# Altium schematic sheet Block_Diagram.SchDoc: Block Diagram
size Letter; Organization: Midnight Sun Solar Rayce Car Team; Address1: University of Waterloo; Address2: 200 University Ave W; Address3: Waterloo, ON, Canada; Address4: N2L 3E9; DocumentNumber: 1; SheetNumber: 1; SheetTotal: 5; Website: www.uwmidsun.com
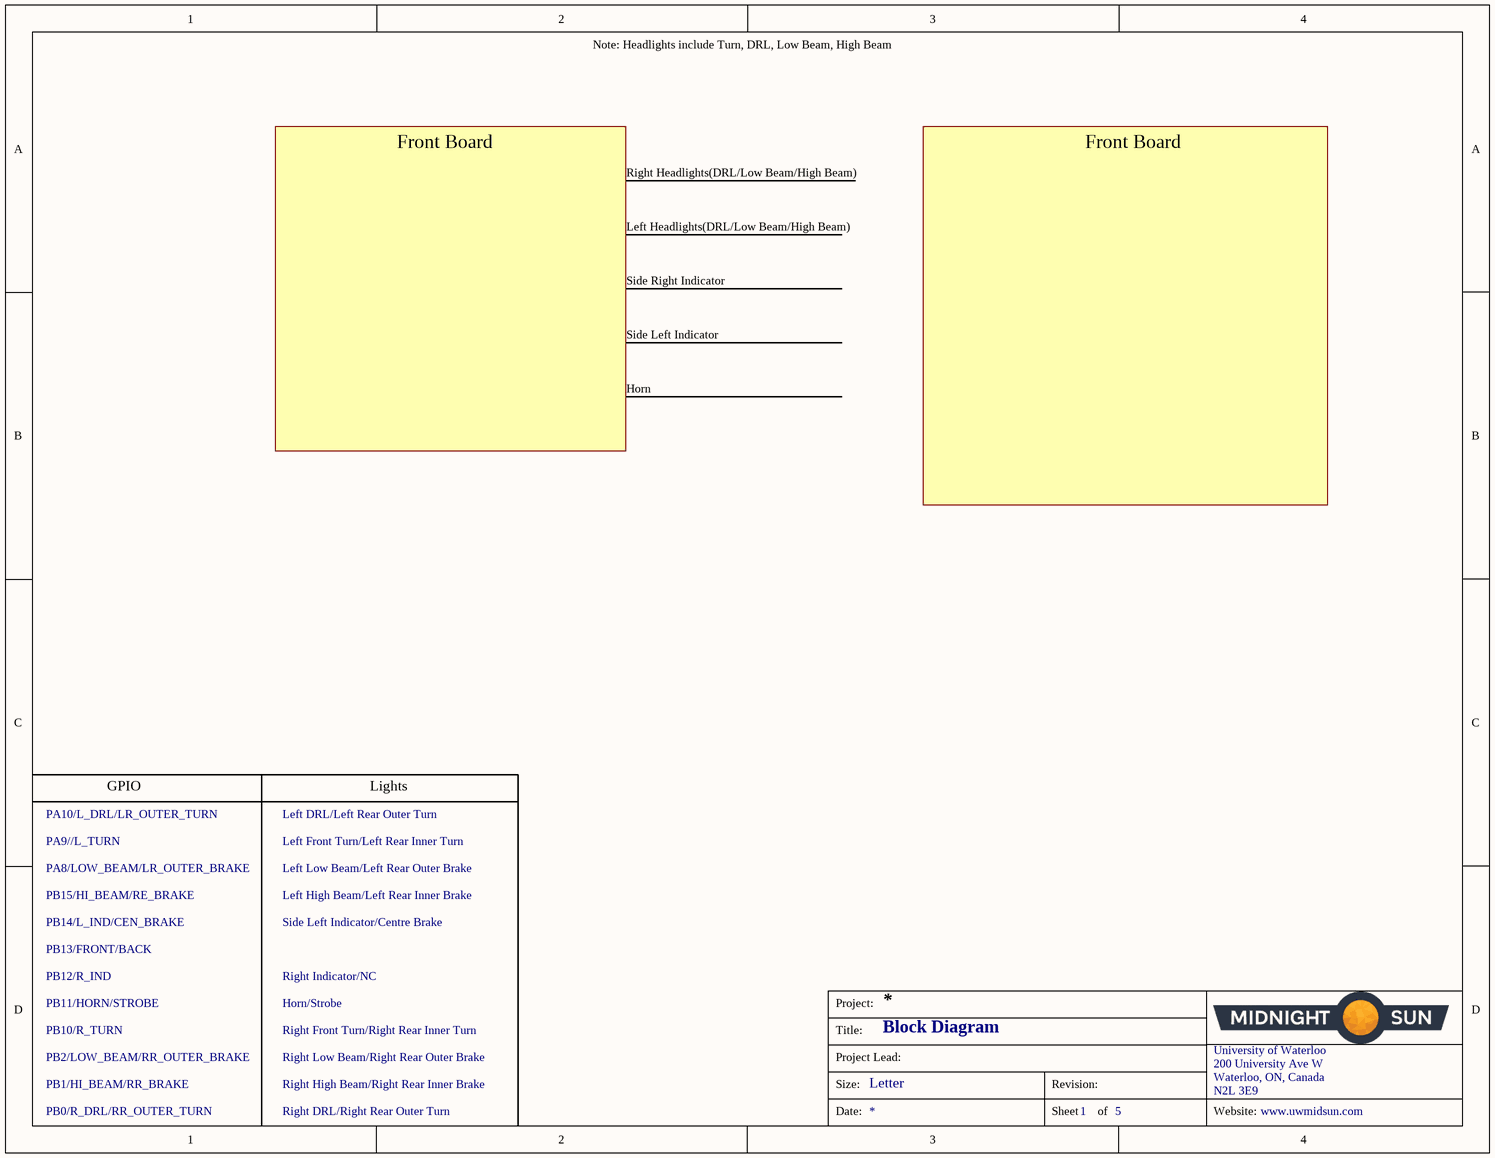
[diagram p0: Block_Diagram.SchDoc]

## Notes on the sheet
- Note: Headlights include Turn, DRL, Low Beam, High Beam
- Front Board
- Right Headlights(DRL/Low Beam/High Beam)
- Left Headlights(DRL/Low Beam/High Beam)
- Side Right Indicator
- Side Left Indicator
- Horn
- PA10/L_DRL/LR_OUTER_TURN
- GPIO
- Left DRL/Left Rear Outer Turn
- Lights
- PA9//L_TURN
- PA8/LOW_BEAM/LR_OUTER_BRAKE
- PB15/HI_BEAM/RE_BRAKE
- Left Front Turn/Left Rear Inner Turn
- Left Low Beam/Left Rear Outer Brake
- Left High Beam/Left Rear Inner Brake
- PB14/L_IND/CEN_BRAKE
- PB13/FRONT/BACK
- Side Left Indicator/Centre Brake
- PB12/R_IND
- PB11/HORN/STROBE
- PB10/R_TURN
- Right Indicator/NC
- Horn/Strobe
- Right Front Turn/Right Rear Inner Turn
- PB2/LOW_BEAM/RR_OUTER_BRAKE
- PB1/HI_BEAM/RR_BRAKE
- Right Low Beam/Right Rear Outer Brake
- Right High Beam/Right Rear Inner Brake
- PB0/R_DRL/RR_OUTER_TURN
- Right DRL/Right Rear Outer Turn
- Project:
- Title:
- Size:
- Project Lead:
- Letter
- Revision:
- University of Waterloo
- 200 University Ave W
- Waterloo, ON, Canada
- N2L 3E9
- Date:
- Sheet
- of
- Website: